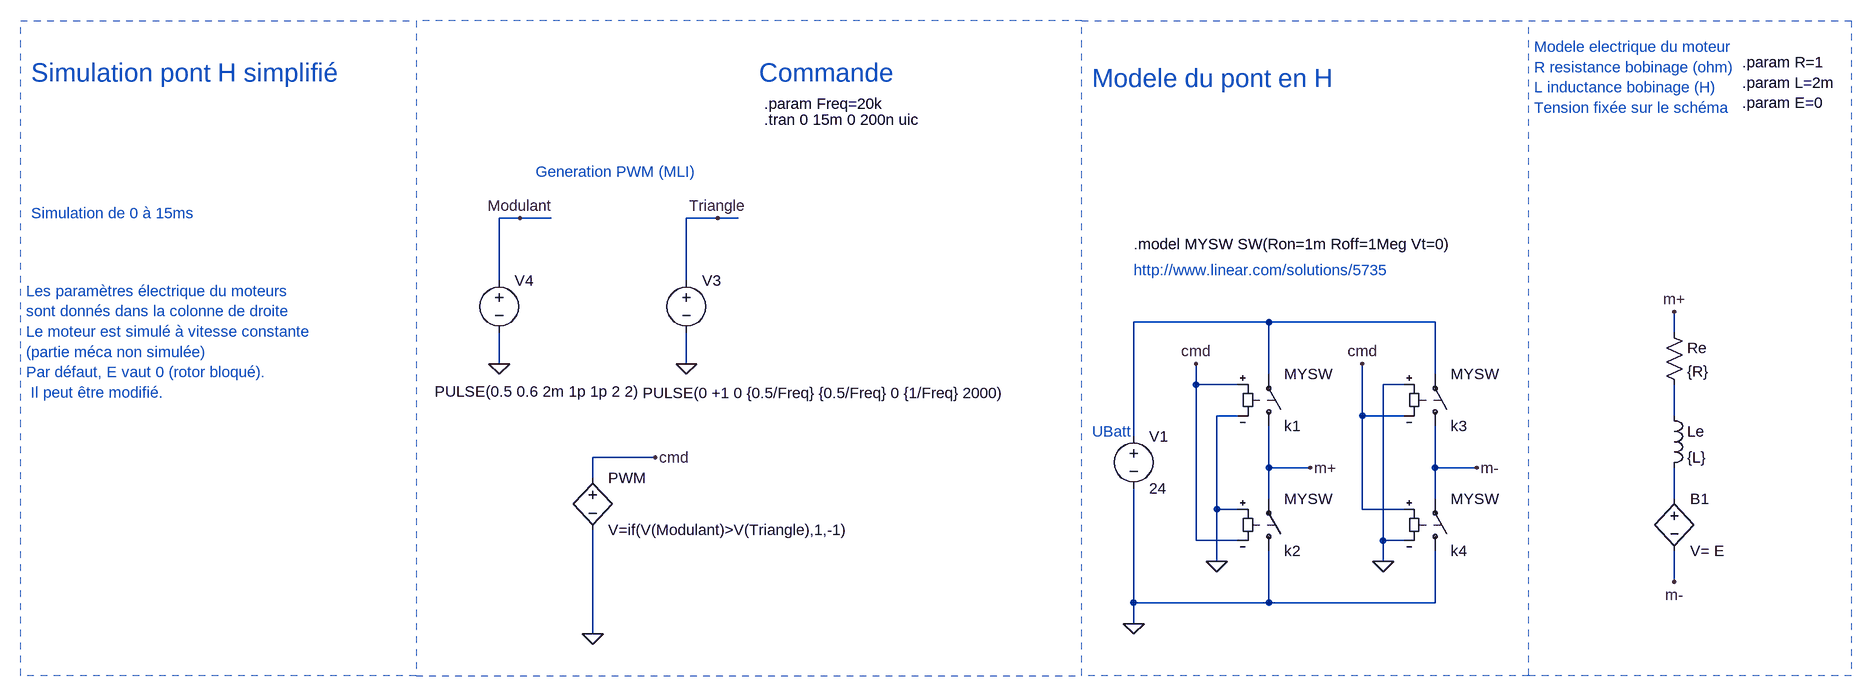
[diagram p0: schematic Hacheur_4Q_Ideal_TD.asc]
Hacheur_4Q_Ideal_TD.asc, the LTspice schematic file:
Version 4
SHEET 1 3136 1132
WIRE -944 -192 -976 -192
WIRE -896 -192 -944 -192
WIRE -640 -192 -688 -192
WIRE -608 -192 -640 -192
WIRE -976 -96 -976 -192
WIRE -688 -96 -688 -192
WIRE 208 -32 0 -32
WIRE 464 -32 208 -32
WIRE 832 -16 832 -48
WIRE -976 32 -976 -16
WIRE -688 32 -688 -16
WIRE 208 48 208 -32
WIRE 464 48 464 -32
WIRE 96 64 96 32
WIRE 160 64 96 64
WIRE 416 64 384 64
WIRE 160 112 128 112
WIRE 352 112 352 32
WIRE 416 112 352 112
WIRE 832 112 832 64
WIRE 0 144 0 -32
WIRE -736 176 -832 176
WIRE 208 192 208 128
WIRE 272 192 208 192
WIRE 464 192 464 128
WIRE 528 192 464 192
WIRE -832 208 -832 176
WIRE 208 240 208 192
WIRE 464 240 464 192
WIRE 832 240 832 192
WIRE 128 256 128 112
WIRE 160 256 128 256
WIRE 352 256 352 112
WIRE 416 256 352 256
WIRE 96 304 96 64
WIRE 160 304 96 304
WIRE 384 304 384 64
WIRE 416 304 384 304
WIRE 128 336 128 256
WIRE 384 336 384 304
WIRE 832 368 832 320
WIRE 0 400 0 224
WIRE 208 400 208 320
WIRE 208 400 0 400
WIRE 464 400 464 320
WIRE 464 400 208 400
WIRE 0 432 0 400
WIRE -832 448 -832 288
FLAG 128 336 0
FLAG 384 336 0
FLAG 96 32 cmd
FLAG 832 -48 m+
FLAG 832 368 m-
FLAG 352 32 cmd
FLAG 272 192 m+
FLAG 528 192 m-
FLAG 0 432 0
FLAG -944 -192 Modulant
FLAG -688 32 0
FLAG -976 32 0
FLAG -640 -192 Triangle
FLAG -832 448 0
FLAG -736 176 cmd
SYMBOL sw 208 144 M180
SYMATTR InstName k1
SYMATTR Value MYSW
SYMBOL sw 464 144 M180
SYMATTR InstName k3
SYMATTR Value MYSW
SYMBOL sw 208 336 M180
SYMATTR InstName k2
SYMATTR Value MYSW
SYMBOL sw 464 336 M180
SYMATTR InstName k4
SYMATTR Value MYSW
SYMBOL res 816 -32 R0
SYMATTR InstName Re
SYMATTR Value {R}
SYMBOL ind 816 96 R0
SYMATTR InstName Le
SYMATTR Value {L}
SYMBOL voltage 0 128 R0
WINDOW 123 0 0 Left 2
WINDOW 39 0 0 Left 2
SYMATTR InstName V1
SYMATTR Value 24
SYMBOL bv 832 224 R0
SYMATTR InstName B1
SYMATTR Value V= E
SYMBOL voltage -688 -112 R0
WINDOW 123 0 0 Left 2
WINDOW 39 0 0 Left 2
WINDOW 3 -67 189 Left 2
SYMATTR InstName V3
SYMATTR Value PULSE(0 +1 0 {0.5/Freq} {0.5/Freq} 0 {1/Freq} 2000)
SYMBOL voltage -976 -112 R0
WINDOW 123 0 0 Left 2
WINDOW 39 0 0 Left 2
WINDOW 3 -99 187 Left 2
SYMATTR InstName V4
SYMATTR Value PULSE(0.5 0.6 2m 1p 1p 2 2)
SYMBOL bv -832 192 R0
SYMATTR InstName PWM
SYMATTR Value V=if(V(Modulant)>V(Triangle),1,-1)
TEXT 0 -152 Left 2 !.model MYSW SW(Ron=1m Roff=1Meg Vt=0)
TEXT 936 -432 Left 2 !.param R=1\n.param L=2m\n.param E=0
TEXT -568 -344 Left 2 !.tran 0 15m 0 200n uic
TEXT 0 -112 Left 2 ;http://www.linear.com/solutions/5735
TEXT -64 -408 Left 4 ;Modele du pont en H
TEXT 616 -456 Left 2 ;Modele electrique du moteur\nR resistance bobinage (ohm)\nL inductance bobinage (H)\nTension fixée sur le schéma
TEXT -576 -416 Left 4 ;Commande
TEXT -568 -368 Left 2 !.param Freq=20k
TEXT -1696 -200 Left 2 ;Simulation de 0 à 15ms
TEXT -1704 -80 Left 2 ;Les paramètres électrique du moteurs \nsont donnés dans la colonne de droite\nLe moteur est simulé à vitesse constante \n(partie méca non simulée)\nPar défaut, E vaut 0 (rotor bloqué).\n Il peut être modifié.
TEXT -1696 -416 Left 4 ;Simulation pont H simplifié
TEXT -64 136 Left 2 ;UBatt
TEXT -920 -264 Left 2 ;Generation PWM (MLI)
LINE Normal -80 -496 608 -496 2
LINE Normal 608 512 -80 512 2
LINE Normal 1104 512 608 512 2
LINE Normal 1104 -496 1104 512 2
LINE Normal 608 -496 1104 -496 2
LINE Normal 608 512 608 -496 2
LINE Normal -1712 -496 -1104 -496 2
LINE Normal -1712 512 -1712 -496 2
LINE Normal -1104 512 -1712 512 2
RECTANGLE Normal -1104 512 -80 -496 2

The netlist it stands for:
* Hacheur_4Q_Ideal_TD.asc
S§k1 m+ N001 cmd 0 MYSW
S§k3 m- N001 0 cmd MYSW
S§k2 0 m+ 0 cmd MYSW
S§k4 0 m- cmd 0 MYSW
Re m+ N002 {R}
Le N002 N003 {L}
V1 N001 0 24
B1 N003 m- V= E
V3 Triangle 0 PULSE(0 +1 0 {0.5/Freq} {0.5/Freq} 0 {1/Freq} 2000)
V4 Modulant 0 PULSE(0.5 0.6 2m 1p 1p 2 2)
B§PWM cmd 0 V=if(V(Modulant)>V(Triangle),1,-1)
.model MYSW SW(Ron=1m Roff=1Meg Vt=0)
.param R=1
.param L=2m
.param E=0
.tran 0 15m 0 200n uic
* http://www.linear.com/solutions/5735
* Modele du pont en H
* Modele electrique du moteur
* R resistance bobinage (ohm)
* L inductance bobinage (H)
* Tension fixée sur le schéma
* Commande
.param Freq=20k
* Simulation de 0 à 15ms
* Les paramètres électrique du moteurs
* sont donnés dans la colonne de droite
* Le moteur est simulé à vitesse constante
* (partie méca non simulée)
* Par défaut, E vaut 0 (rotor bloqué).
*  Il peut être modifié.
* Simulation pont H simplifié
* UBatt
* Generation PWM (MLI)
.backanno
.end